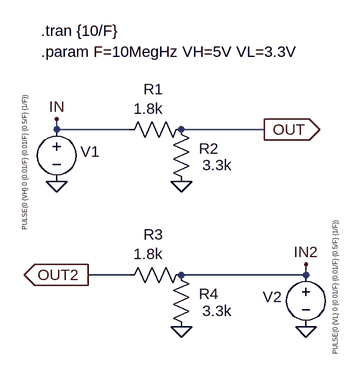
[diagram p0: schematic v1.0.asc]
v1.0.asc, the LTspice schematic file:
Version 4.1
SHEET 1 880 680
WIRE -80 128 -80 112
WIRE 32 128 -80 128
WIRE 240 128 112 128
WIRE 32 352 -32 352
WIRE 304 352 304 336
WIRE 304 352 112 352
FLAG 112 208 0
FLAG -80 208 0
FLAG 240 128 OUT
IOPIN 240 128 Out
FLAG -80 112 IN
FLAG 112 432 0
FLAG 304 432 0
FLAG -32 352 OUT2
IOPIN -32 352 Out
FLAG 304 336 IN2
SYMBOL res 128 112 R90
WINDOW 0 -31 59 VBottom 2
WINDOW 3 -32 67 VTop 2
SYMATTR InstName R1
SYMATTR Value 1.8k
SYMBOL res 128 224 R180
WINDOW 0 -42 67 Left 2
WINDOW 3 -62 41 Left 2
SYMATTR InstName R2
SYMATTR Value 3.3k
SYMBOL voltage -80 112 R0
WINDOW 0 37 50 Left 2
WINDOW 3 -49 -40 VRight 0
WINDOW 123 0 0 Left 0
WINDOW 39 0 0 Left 0
SYMATTR InstName V1
SYMATTR Value PULSE(0 {VH} 0 {0.01/F} {0.01/F} {0.5/F} {1/F})
SYMBOL res 128 336 R90
WINDOW 0 -31 59 VBottom 2
WINDOW 3 -32 67 VTop 2
SYMATTR InstName R3
SYMATTR Value 1.8k
SYMBOL res 128 448 R180
WINDOW 0 -42 67 Left 2
WINDOW 3 -62 41 Left 2
SYMATTR InstName R4
SYMATTR Value 3.3k
SYMBOL voltage 304 336 M0
WINDOW 0 37 50 Left 2
WINDOW 3 -45 -71 VRight 0
WINDOW 123 0 0 Left 0
WINDOW 39 0 0 Left 0
SYMATTR InstName V2
SYMATTR Value PULSE(0 {VL} 0 {0.01/F} {0.01/F} {0.5/F} {1/F})
TEXT -104 -24 Left 2 !.tran {10/F}
TEXT -104 8 Left 2 !.param F=10MegHz VH=5V VL=3.3V

The netlist it stands for:
* v1.0.asc
R1 OUT IN 1.8k
R2 0 OUT 3.3k
V1 IN 0 PULSE(0 {VH} 0 {0.01/F} {0.01/F} {0.5/F} {1/F})
R3 IN2 OUT2 1.8k
R4 0 IN2 3.3k
V2 IN2 0 PULSE(0 {VL} 0 {0.01/F} {0.01/F} {0.5/F} {1/F})
.tran {10/F}
.param F=10MegHz VH=5V VL=3.3V
.backanno
.end

* Results of the author's LTspice run, read from the files saved beside the schematic
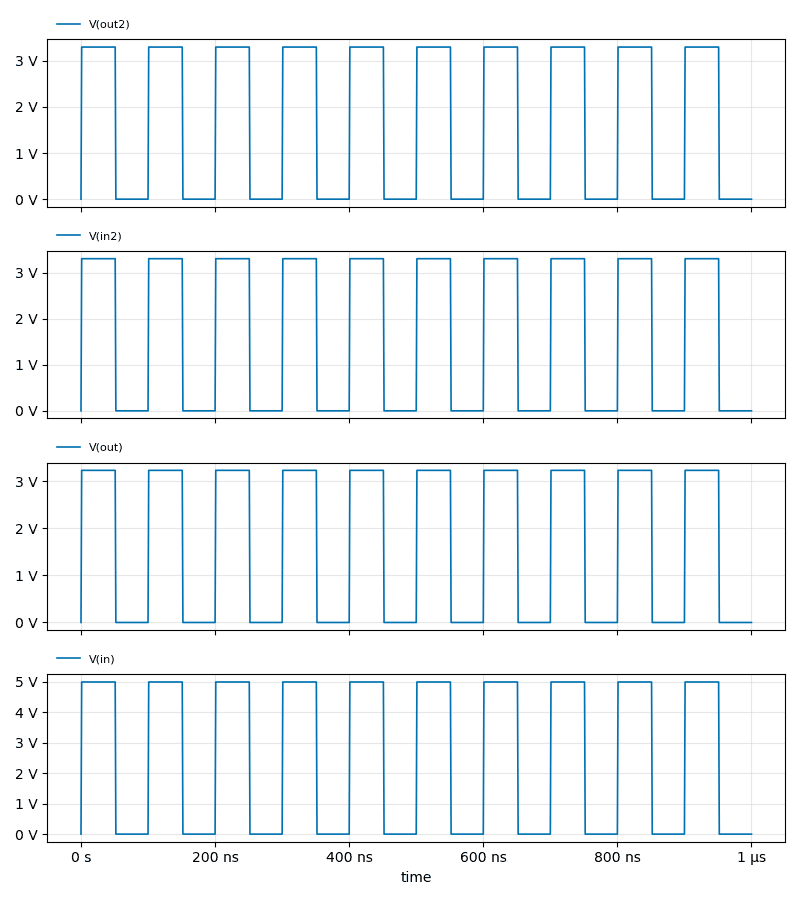
[diagram p1: Transient Analysis of v1.0.asc, plotted from the saved traces]
* Transient Analysis, 1 run:
*   V(out2): min 0 V, max 3.3 V, average 1.683 V, rms 2.357 V, last 0 V
*   V(in2): min 0 V, max 3.3 V, average 1.683 V, rms 2.357 V, last 0 V
*   V(out): min 0 V, max 3.235 V, average 1.65 V, rms 2.31 V, last 0 V
*   V(in): min 0 V, max 5 V, average 2.55 V, rms 3.571 V, last 0 V